# EAGLE design ChargeBoost (EAGLE 7.7.0)
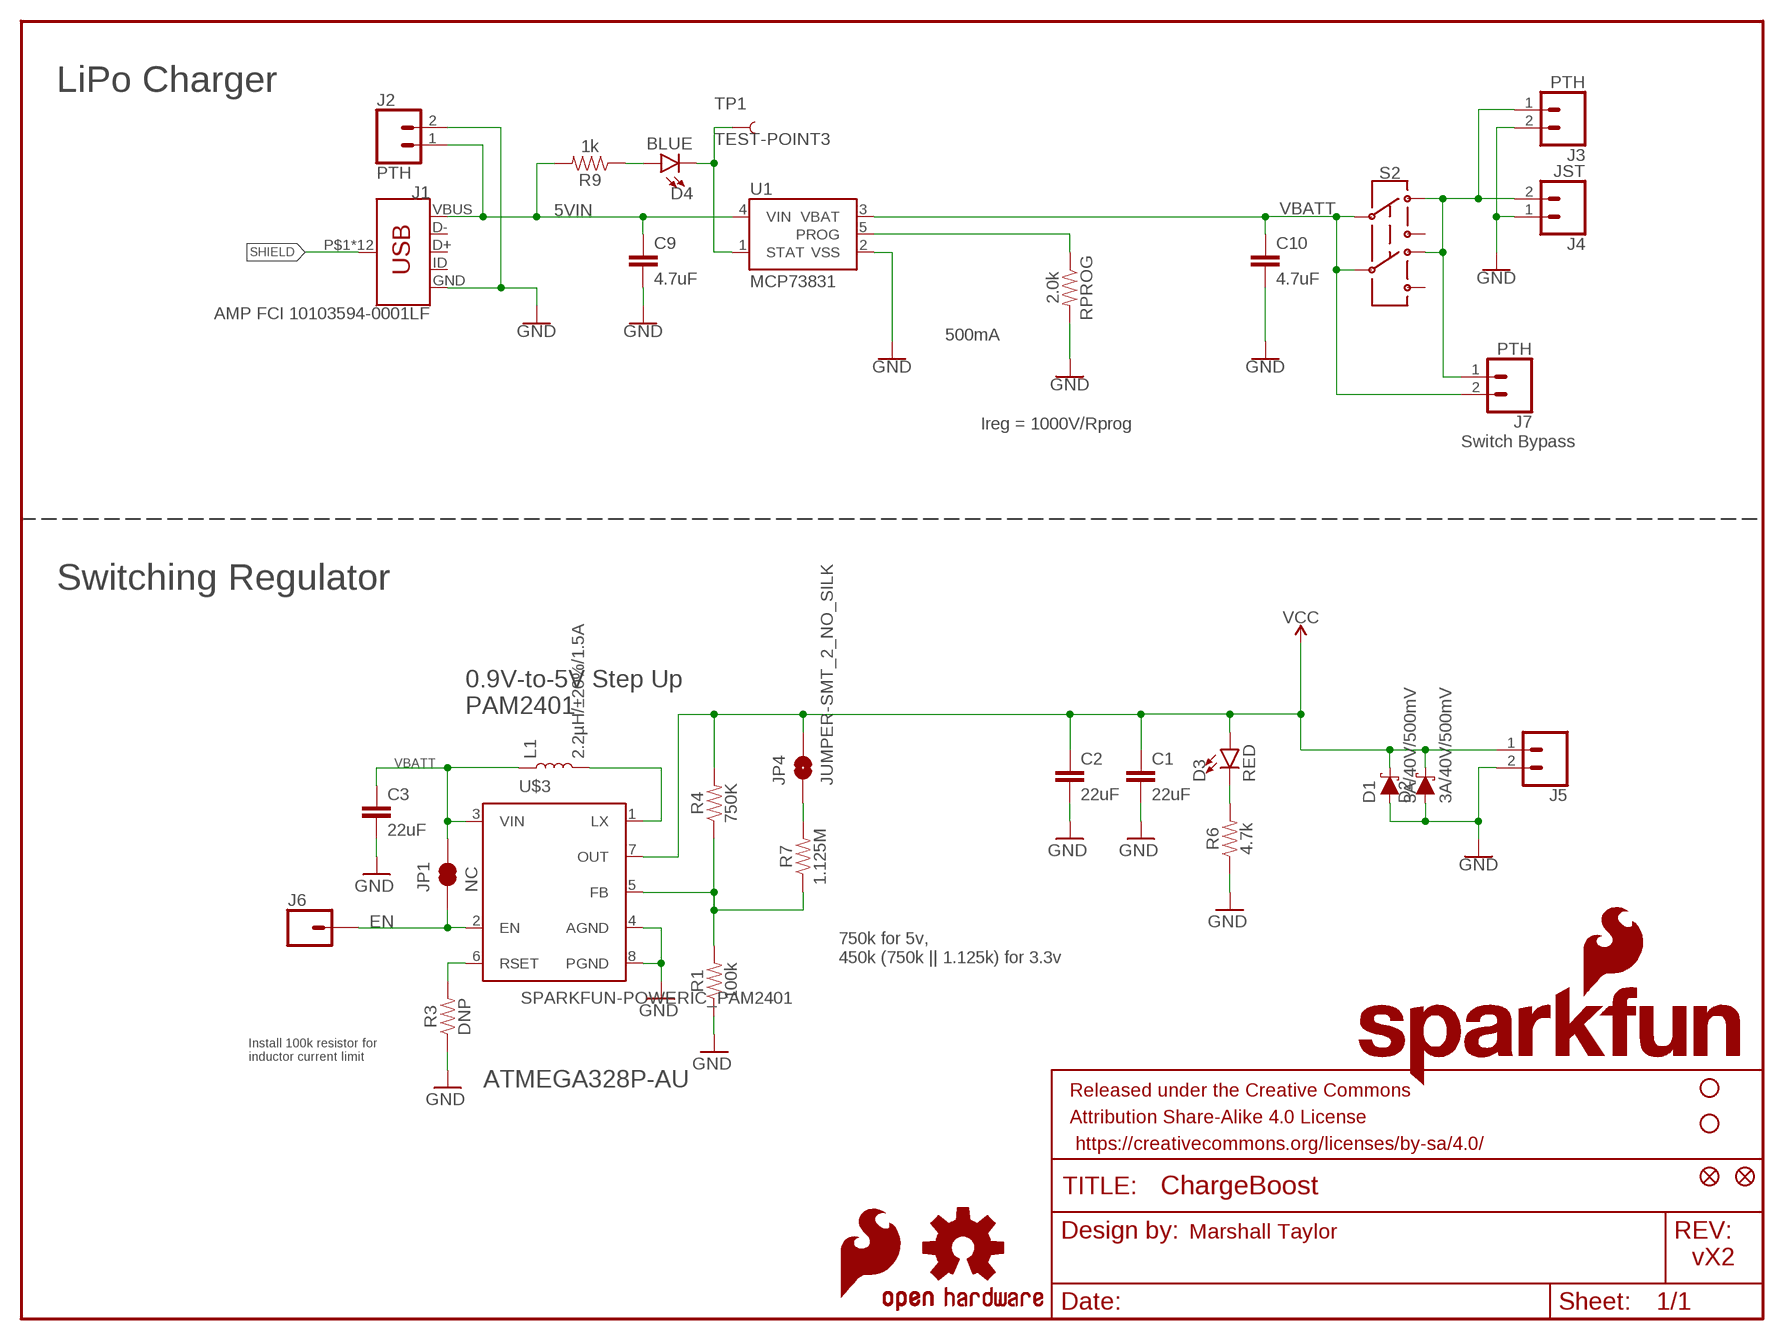
[diagram p0: schematic, sheet 1]

## Parts
C1  22uF  22UF-0805-6.3V-20%  [0805]
C2  22uF  22UF-0805-6.3V-20%  [0805]
C3  22uF  22UF-0805-6.3V-20%  [0805]
C9  4.7uF  4.7UF0603  [0603]
C10  4.7uF  4.7UF0603  [0603]
D1  3A/40V/500mV  DIODE-SCHOTTKY-B340A  [SMA-DIODE]
D2  3A/40V/500mV  DIODE-SCHOTTKY-B340A  [SMA-DIODE]
D3  RED  LED-RED0603  [LED-0603]
D4  BLUE  LED-BLUE0603  [LED-0603]
FRAME1  FRAME-LETTER  [CREATIVE_COMMONS]
J1  AMP FCI 10103594-0001LF  USB_MICRO-B_HALF_PTH  [USB-MICROB-PTH]
J2  PTH  CONN_02  [1X02]
J3  PTH  CONN_02  [1X02]
J4  JST  CONN_02-JST-2MM-SMT  [JST-2-SMD]
J5  CONN_02  [1X02]
J6  CONN_01  [1X01]
J7  PTH  CONN_02  [1X02]
JP1  NC  JUMPER-SMT_2_NC_TRACE_NO-SILK  [SMT-JUMPER_2_NC_TRACE_NO-SILK]
JP2  FIDUCIAL1X2  [FIDUCIAL-1X2]
JP3  SFE_LOGO_NAME_FLAME.1_INCH  [SFE_LOGO_NAME_FLAME_.1]
JP4  JUMPER-SMT_2_NO_SILK  [SMT-JUMPER_2_NO_SILK]
JP6  STAND-OFF  [STAND-OFF]
JP7  STAND-OFF  [STAND-OFF]
JP16  FIDUCIAL1X2  [FIDUCIAL-1X2]
L1  2.2µH/±20%/1.5A  INDUCTORCOPY-VLF4012AT-2.2UH  [INDUCTOR_2.2UHCOPY]
LOGO1  SFE_LOGO_FLAME.1_INCH  [SFE_LOGO_FLAME_.1]
R1  100k  100KOHM-0603-1/10W-1%  [0603]
R3  DNP  100KOHM-0603-1/10W-1%  [0603]
R4  750K  750OHM-0603-1/10W-1%  [0603]
R6  4.7k  4.7KOHM-0603-1/10W-1%  [0603]
R7  1.125M  750OHM-0603-1/10W-1%  [0603]
R9  1k  1KOHM-0603-1/10W-1%  [0603]
RPROG  2.0k  2.0KOHM-0603-1/10W-5%  [0603]
S2  SWITCH-DPDT-SMD-AYZ0202  [SWITCH_DPDT_SMD_AYZ0202]
TP1  TEST-POINT3  [PAD.03X.03]
U1  MCP73831  [SOT23-5]
U$1  OSHW-LOGOS  [OSHW-LOGO-S]
U$3  SPARKFUN-POWERIC_PAM2401  [SPARKFUN-POWERIC_MSOP8]

## Nets
5VIN: C9.1 J1.VBUS J2.1 R9.2 U1.4(VIN)
EN: J6.1 JP1.1 U$3.2(EN)
GND: C1.2 C2.2 C3.2 C9.2 C10.2 D1.A D2.A J1.GND J2.2 J3.2 J4.1 J5.2 R1.1 R3.1 R6.1 RPROG.2 U1.2(VSS) U$3.4(AGND) U$3.8(PGND)
N$1: JP4.1 R7.2
N$2: D3.C R6.2
N$3: D4.A R9.1
N$4: L1.P$2 U$3.1(LX)
N$6: R3.2 U$3.6(RSET)
N$9: J3.1 J4.2 J7.1 S2.1 S2.4
N$11: RPROG.1 U1.5(PROG)
N$12: R1.2 R4.1 R7.1 U$3.5(FB)
N$14: D4.C TP1.P$1 U1.1(STAT)
SHIELD: J1.P$1(SHIELD) J1.P$2(SHIELD) J1.P$3(SHIELD) J1.P$4(SHIELD) J1.P$6(SHIELD) J1.P$8(SHIELD) J1.P$10(SHIELD) J1.P$12(SHIELD) J1.SHEILD2(SHIELD) J1.SHIELD J1.SHIELD3(SHIELD) J1.SHIELD4(SHIELD)
VBATT: C3.1 C10.1 J7.2 JP1.2 L1.P$1 S2.2 S2.5 U1.3(VBAT) U$3.3(VIN)
VCC: C1.1 C2.1 D1.C D2.C D3.A J5.1 JP4.2 R4.2 U$3.7(OUT)
Unconnected: J1.D+ J1.D- J1.ID S2.3 S2.6

## Notes on the sheet
- LiPo Charger
- 500mA
- Ireg = 1000V/Rprog
- Switch Bypass
- Switching Regulator
- 0.9V-to-5V Step Up
  PAM2401
- 750k for 5v,
  450k (750k || 1.125k) for 3.3v
- Install 100k resistor for
  inductor current limit
- ATMEGA328P-AU
- Marshall Taylor
- vX2

## Library data of the parts
C1-C3 = SparkFun-Capacitors:22UF: 22µF ceramic capacitors A capacitor is a passive two-terminal electrical component used to store electrical energy temporarily in an electric field.; PROD_ID: CAP-08402
C9 C10 = SparkFun-Capacitors:4.7UF: 4.7µF ceramic capacitors A capacitor is a passive two-terminal electrical component used to store electrical energy temporarily in an electric field.; PROD_ID: CAP-08280
D1 D2 = SparkFun-DiscreteSemi:DIODE-SCHOTTKY: Schottky diode A Schottky diode is a semiconductor diode which has a low forward voltage drop and a very fast switching action.; PROD_ID: DIO-09886
D3 = SparkFun-LED:LED-RED: Red SMD LED Used in manufacturing of most products at SparkFun Packages: 0603 - SMD 0603 package [Product Link] <http://docs.avagotech.com/docs/AV02-0551EN> 0603 SMART - SMD 0603 SMART package ( more efficient and expensive)[Product Link] <http://www.osram-os.com/Graphics/XPic2/00077099_0.pdf> 1206 - SMD1206 package [Product Link] <https://www.sparkfun.com/datasheets/DevTools/LilyPad/Q150OVS4.pdff> SparkFun Products: Pro Mini 328 -5V <https://www.sparkfun.com/products/821> RedBoard <https://www.sparkfun.com/products/12757> IOIO-OTG <https://www.sparkfun.com/products/13613>; PROD_ID: DIO-00819
D4 = SparkFun-LED:LED-BLUE: Blue SMD LED Used in manufacturing of various products at SparkFun Packages: 0603 - SMD 0603 package [Product Link] <http://www.digikey.com/product-detail/en/SMLE12BC7TT86/511-1589-2-ND/1641808> 1206 - SMD1206 package [Product Link] <http://www.digikey.com/product-detail/en/lite-on-inc/LTST-C150TBKT/160-1643-1-ND/573584> SparkFun Products: ESP8266 Thing-Dev Board <https://www.sparkfun.com/products/13711> RedBoard <https://www.sparkfun.com/products/12757>; PROD_ID: DIO-08575
FRAME1 = SparkFun-Aesthetics:FRAME-LETTER: Schematic Frame - Letter Standard 8.5x11 US Letter frame
J1 = SparkFun-Connectors:USB_MICRO-B: USB Type Micro-B Connector Male/female and PTH/SMT variants SparkFun Products: SparkFun microB USB Breakout <https://www.sparkfun.com/products/12035> SparkFun USB microB Plug Breakout <https://www.sparkfun.com/products/10031> SparkFun ESP8266 Thing <https://www.sparkfun.com/products/13231>; PROD_ID: CONN-13711
J2 J3 J5 J7 = SparkFun-Connectors:CONN_02: Multi connection point. Often used as Generic Header-pin footprint for 0.1 inch spaced/style header connections On any of the 0.1 inch spaced packages, you can populate with these: Break Away Headers - Straight <https://www.sparkfun.com/products/116> (PRT-00116) Break Away Male Headers - Right Angle <https://www.sparkfun.com/products/553> (PRT-00553) Female Headers <https://www.sparkfun.com/products/115> (PRT-00115) Break Away Headers - Machine Pin <https://www.sparkfun.com/products/117> (PRT-00117) Break Away Female Headers - Swiss Machine Pin <https://www.sparkfun.com/products/743> (PRT-00743) For SCREWTERMINALS and SPRING TERMINALS visit here: Screw Terimnals on SparkFun.com <https://www.sparkfun.com/search/results?term=Screw+Terminals> (5mm/3.5mm/2.54mm spacing) This device is also useful as a general connection point to wire up your design to another part of your project. Our various solder wires solder well into these plated through hole pads. Hook-Up Wire - Assortment (Stranded, 22 AWG) <https://www.sparkfun.com/products/11375> (PRT-11375) Hook-Up Wire - Assortment (Solid Core, 22 AWG) <https://www.sparkfun.com/products/11367> (PRT-11367) View the entire wire category on our website here <https://www.sparkfun.com/categories/141> Special notes: Molex polarized connector foot print use with: PRT-08233 with associated crimp pins and housings. 2.54_SCREWTERM for use with PRT-10571. 3.5mm Screw Terminal footprints for PRT-08084 5mm Screw Terminal footprints for use with PRT-08432
J4 = SparkFun-Connectors:CONN_02: Multi connection point. Often used as Generic Header-pin footprint for 0.1 inch spaced/style header connections On any of the 0.1 inch spaced packages, you can populate with these: Break Away Headers - Straight <https://www.sparkfun.com/products/116> (PRT-00116) Break Away Male Headers - Right Angle <https://www.sparkfun.com/products/553> (PRT-00553) Female Headers <https://www.sparkfun.com/products/115> (PRT-00115) Break Away Headers - Machine Pin <https://www.sparkfun.com/products/117> (PRT-00117) Break Away Female Headers - Swiss Machine Pin <https://www.sparkfun.com/products/743> (PRT-00743) For SCREWTERMINALS and SPRING TERMINALS visit here: Screw Terimnals on SparkFun.com <https://www.sparkfun.com/search/results?term=Screw+Terminals> (5mm/3.5mm/2.54mm spacing) This device is also useful as a general connection point to wire up your design to another part of your project. Our various solder wires solder well into these plated through hole pads. Hook-Up Wire - Assortment (Stranded, 22 AWG) <https://www.sparkfun.com/products/11375> (PRT-11375) Hook-Up Wire - Assortment (Solid Core, 22 AWG) <https://www.sparkfun.com/products/11367> (PRT-11367) View the entire wire category on our website here <https://www.sparkfun.com/categories/141> Special notes: Molex polarized connector foot print use with: PRT-08233 with associated crimp pins and housings. 2.54_SCREWTERM for use with PRT-10571. 3.5mm Screw Terminal footprints for PRT-08084 5mm Screw Terminal footprints for use with PRT-08432; PROD_ID: CONN-11443
J6 = SparkFun-Connectors:CONN_01: Single connection point. Often used as Generic Header-pin footprint for 0.1 inch spaced/style header connections On any of the 0.1 inch spaced packages, you can populate with these: Break Away Headers - Straight <https://www.sparkfun.com/products/116> (PRT-00116) Break Away Male Headers - Right Angle <https://www.sparkfun.com/products/553> (PRT-00553) Female Headers <https://www.sparkfun.com/products/115> (PRT-00115) Break Away Headers - Machine Pin <https://www.sparkfun.com/products/117> (PRT-00117) Break Away Female Headers - Swiss Machine Pin <https://www.sparkfun.com/products/743> (PRT-00743) This device is also useful as a general connection point to wire up your design to another part of your project. Our various solder wires solder well into these plated through hole pads. Hook-Up Wire - Assortment (Stranded, 22 AWG) <https://www.sparkfun.com/products/11375> (PRT-11375) Hook-Up Wire - Assortment (Solid Core, 22 AWG) <https://www.sparkfun.com/products/11367> (PRT-11367) View the entire wire category on our website here <https://www.sparkfun.com/categories/141> Special notes: SMTSO-256-ET is a "flush mount" nut for a 4-40 screw. We mostly use this on specialty testbeds; it is a nice way to connect hardware to your PCB at an adjustable hieght. Also note, the SNAP packages are for using a snappable style connector. We sell a baggie of snaps and they are also used on two LilyPad designs: Snap Assortment - 30 pack (male and female) <https://www.sparkfun.com/products/11347> (DEV-11347) LilyPad Arduino SimpleSnap <https://www.sparkfun.com/products/10941> (DEV-10941) LilyPad SimpleSnap Protoboard <https://www.sparkfun.com/products/10940> (DEV-10940)
JP1 = SparkFun-Jumpers:JUMPER-SMT_2_NC_TRACE: Normally closed trace jumper This jumper has a trace between two pads so it's normally closed (NC). Use a razor knife to open the connection. For best results follow the IPC guidelines for cutting traces: Cutout at least 0.063 mm (0.005 in). Remove all loose material to clean up the cut area. Seal the cut with an approved epoxy. Reapply solder to reclose the connection.
JP2 JP16 = SparkFun-Aesthetics:FIDUCIAL: Fiducial Alignment Points Point-of-reference for pick-and-place machines and other optical instruments.
JP3 = SparkFun-Aesthetics:SFE_LOGO_NAME_FLAME: SparkFun Font Logo w/ Flame This is the SparkFun full logo. The logo on the schematic will always be the same size; the package variant is the height of the flame part of the logo. Default layer for the logo on the board is tSilk.
JP4 = SparkFun-Jumpers:JUMPER-SMT_2_NO: Normally open jumper This jumper has two pads in close proximity to each other. Apply solder to close the connection. Round pads are easier to solder for beginners, but are a lot larger. SparkFun Product that uses the round pads: SparkFun EL Sequencer <https://www.sparkfun.com/products/12781>
JP6 JP7 = SparkFun:STAND-OFF: Stand Off This is the mechanical footprint for a #4 phillips button head screw. Use the keepout ring to avoid running the screw head into surrounding components. SKU : PRT-00447
L1 = DuplicatedCoils:INDUCTORCOPY: Inductors Resist changes in electrical current. Basically a coil of wire. SparkFun Products: SparkFun Load Cell Amplifier - HX711 <https://www.sparkfun.com/products/13879> IOIO-OTG - V2.2 <https://www.sparkfun.com/products/13613>; PROD_ID: NDUC-09513
LOGO1 = SparkFun-Aesthetics:SFE_LOGO_FLAME: SparkFun Flame Logo This is the SparkFun flame logo. The logo on the schematic will always be the same size; the package variant is the height of the flame. Default layer for the logo on the board is tSilk.
R1 = SparkFun-Resistors:100KOHM: 100kΩ resistor A resistor is a passive two-terminal electrical component that implements electrical resistance as a circuit element. Resistors act to reduce current flow, and, at the same time, act to lower voltage levels within circuits. - Wikipedia; PROD_ID: RES-07828
R3 = SparkFun-Resistors:100KOHM: 100kΩ resistor A resistor is a passive two-terminal electrical component that implements electrical resistance as a circuit element. Resistors act to reduce current flow, and, at the same time, act to lower voltage levels within circuits. - Wikipedia; PROD_ID: RES-07828; VALUE: 100k
R4 R7 = SparkFun-Resistors:750OHM: 750Ω resistor A resistor is a passive two-terminal electrical component that implements electrical resistance as a circuit element. Resistors act to reduce current flow, and, at the same time, act to lower voltage levels within circuits. - Wikipedia; PROD_ID: RES-07824; VALUE: 750
R6 = SparkFun-Resistors:4.7KOHM: 4.7kΩ resistor A resistor is a passive two-terminal electrical component that implements electrical resistance as a circuit element. Resistors act to reduce current flow, and, at the same time, act to lower voltage levels within circuits. - Wikipedia; PROD_ID: RES-07857
R9 = SparkFun-Resistors:1KOHM: 1kΩ resistor A resistor is a passive two-terminal electrical component that implements electrical resistance as a circuit element. Resistors act to reduce current flow, and, at the same time, act to lower voltage levels within circuits. - Wikipedia; PROD_ID: RES-07856
RPROG = SparkFun-Resistors:2.0KOHM: 2kΩ resistor A resistor is a passive two-terminal electrical component that implements electrical resistance as a circuit element. Resistors act to reduce current flow, and, at the same time, act to lower voltage levels within circuits. - Wikipedia; PROD_ID: RES-08296
S2 = SparkFun-Switches:SWITCH-DPDT: Double-Pole, Double-Throw (DPDT) Switch Double-pole, double-throw switches. Variant Overview PTH-GPI-152-3013 Used on SparkFun Geiger Counter <https://www.sparkfun.com/products/11345> SMD-AY0202 Surface Mount DPDT Switch <https://www.sparkfun.com/products/597> (COM-00597) Used on e.g. LilyPad Arduino USB - ATmega32U4 Board <https://www.sparkfun.com/products/12049>; PROD_ID: SWCH-08179; SF_SKU: COM-00597
TP1 = SparkFun-Connectors:TEST-POINT: SparkFun Test Points Bare copper test points for troubleshooting or In-Circuit-Testing. These are used by our Production team for verifying production board runs using pogo-pins on test beds. SparkFun Products: SparkFun LSM9DS1 Breakout <https://www.sparkfun.com/products/13284> SparkFun PSOC <https://www.sparkfun.com/products/13714> SparkFun Load Cell Amplifier <https://www.sparkfun.com/products/13879>
U1 = SparkFun-IC-Power:MCP73831: MCP73831T Li-Ion, Li-Pol Controller Miniature single cell, fully integrated Li-Ion, Li-polymer charge management controller Datasheet <http://ww1.microchip.com/downloads/en/DeviceDoc/20001984g.pdf> SparkFun Products: SparkFun ESP32 Thing <https://www.sparkfun.com/products/13907> SparkFun 9DoF Razor IMU M0 <https://www.sparkfun.com/products/14001>; PROD_ID: IC-09995
U$1 = SparkFun:OSHW-LOGO: Open Source Hardware Logo This logo indicates the piece of hardware it is found on incorporates a OSHW license and/or adheres to the definition of open source hardware found here: http://freedomdefined.org/OSHW
U$3 = Apo Board 2017 ATmega328SMD_PAM2401:SPARKFUN-POWERIC_PAM2401

## Net classes
0 default: width 0.152 mm, drill 0.305 mm, clearance 0.152 mm

## Board
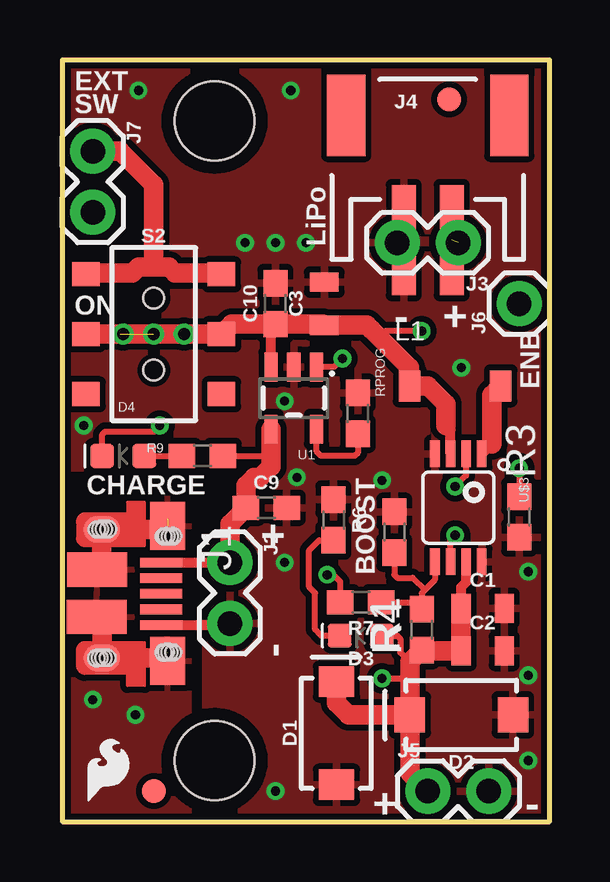
[diagram p1: board, top side]
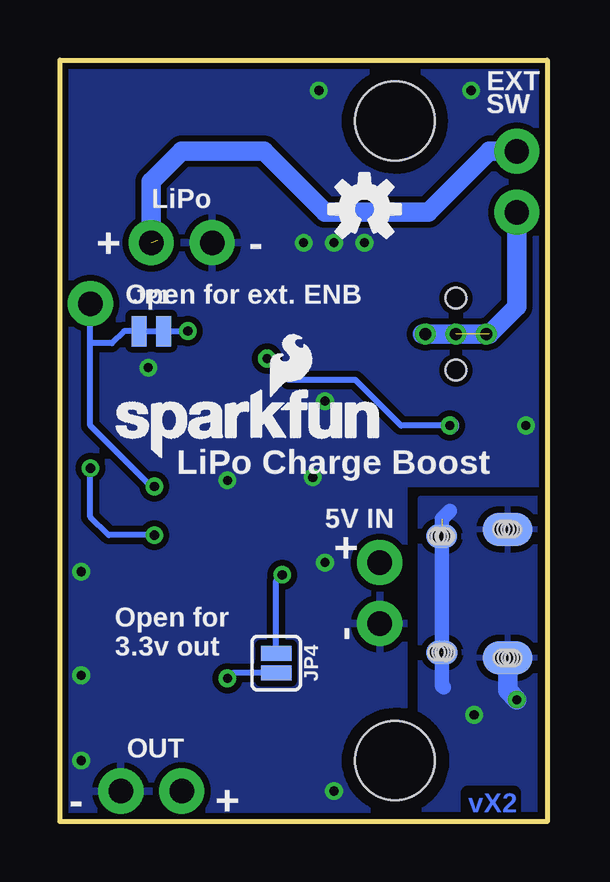
[diagram p2: board, bottom side, seen from below]

Size 20.32 x 31.75 mm. Coordinates in mm from the lower left corner, seen from the top.
Outline: 0,0 20.32,0 20.32,31.75 0,31.75 0,0
Copper layers (1*16): Top 0.035mm / dielectric 1.5mm / Bottom 0.035mm
Design rules "SparkFun-2-layer-TIGHT": minimum track width 7mil, minimum drill 15mil, track to track 7mil, track to pad 7mil, pad to pad 7mil, via to via 7mil, smd to smd 7mil, copper to edge 7mil, drill to drill 7mil, minimum pad ring 7mil, minimum via ring 7mil, stop-mask expansion 4mil, vias tented up to drill 25mil, thermal gap 10mil

### Footprints (pad centres in the part's own frame; a part is rotated, then mirrored left to right if it is on the bottom)
0805 = smd 0.8 x 1.2: 1 -0.9,0; 2 0.9,0
0603 = smd 1.1 x 1: 1 -0.85,0; 2 0.85,0
SMA-DIODE = smd 1.27 x 1.47: A -2.15,0; C 2.15,0
LED-0603 = smd 1 x 1: A -0.877,0; C 0.877,0
USB-MICROB-PTH = smd 0.4 x 1.75: D+ 0.031,1.331; D- -0.619,1.331; GND 1.331,1.331; ID 0.681,1.331; VBUS -1.269,1.331 | smd 1.4 x 2.1 bottom: P$1 2.701,-1.142; P$3 -2.659,-1.144 | smd 1 x 1.3: P$2 2.487,1.594; P$6 -2.368,1.604 | smd 1 x 1.3 bottom: P$4 -2.368,1.604; P$10 2.481,1.598 | smd 1.1 x 1.5: P$8 2.701,-1.142; P$12 -2.659,-1.144 | smd 2 x 1.46: SHEILD2 2.831,1.606; SHIELD -2.794,1.606 | smd 1.425 x 2.5: SHIELD3 -0.979,-1.349; SHIELD4 0.996,-1.352 | hole 0.66: -2.659,-0.879; 2.477,1.821; 2.461,1.666; 2.481,1.426; 2.467,1.536; -2.659,-1.059; -2.659,-1.219; -2.649,-1.349; 2.701,-0.899; 2.701,-1.079; 2.701,-1.239; 2.711,-1.369; -2.369,1.821; -2.359,1.691; -2.369,1.541; -2.364,1.432
1X02 = drill 1.016 pad 1.88: 1 0,0; 2 2.54,0
JST-2-SMD = smd 1 x 4.6: 1 -1,-3.7; 2 1,-3.7 | smd 1.6 x 3.4: NC1 -3.4,1.5; NC2 3.4,1.5
1X01 = drill 1.016 pad 1.88: 1 0,0
SMT-JUMPER_2_NC_TRACE_NO-SILK = smd 0.635 x 1.27: 1 -0.508,0; 2 0.508,0
FIDUCIAL-1X2 = smd 1 x 1: 1 0,0
SMT-JUMPER_2_NO_SILK = smd 0.635 x 1.27: 1 -0.406,0; 2 0.406,0
STAND-OFF = hole 3.302: 0,0
INDUCTOR_2.2UHCOPY = smd 0.9 x 1.3: P$1 -1.9,0; P$2 1.9,0
SWITCH_DPDT_SMD_AYZ0202 = smd 1 x 1.15: 1 -2.5,2.825; 2 0,2.825; 3 2.5,2.825; 4 -2.5,-2.825; 5 0,-2.825; 6 2.5,-2.825 | hole 0.85: 1.5,0; -1.5,0
PAD.03X.03 = smd 0.762 x 0.762: P$1 0,0
SOT23-5 = smd 0.55 x 1.2: 1 -0.95,-1.3; 2 0,-1.3; 3 0.95,-1.3; 4 0.95,1.3; 5 -0.95,1.3
SPARKFUN-POWERIC_MSOP8 = smd 0.4 x 1.1: 1 -0.975,-2.25; 2 -0.325,-2.25; 3 0.325,-2.25; 4 0.975,-2.25; 5 0.975,2.25; 6 0.325,2.25; 7 -0.325,2.25; 8 -0.975,2.25

### Placement (x,y rotation side)
C1  17.53,8.89 0 top
C2  17.53,7.11 0 top
C3  10.92,21.59 90 top
C9  8.51,13.08 0 top
C10  8.89,21.59 90 top
D1  11.43,3.68 90 top
D2  16.64,4.45 180 top
D3  12.45,7.75 180 top
D4  2.54,15.24 180 top
FRAME1  -24.43,-24.45 0 top  (outside the outline)
J1  2.79,9.53 270 top
J2  6.99,10.79 270 top
J3  16.51,24.13 180 top
J4  15.24,27.94 0 top
J5  15.24,1.27 0 top
J6  19.05,21.59 90 top
J7  1.27,27.94 270 top
JP1  16.51,20.45 0 bottom
JP2  3.81,1.27 0 top
JP3  18.39,15.09 0 bottom
JP4  11.3,6.6 270 bottom
JP6  6.35,2.54 0 top
JP7  6.35,29.21 0 top
JP16  16.13,30.1 0 top
L1  16.38,18.16 0 top
LOGO1  0.76,0.51 0 top
R1  13.84,12.06 270 top
R3  19.05,12.7 90 top
R4  14.99,8 270 top
R6  11.3,12.57 270 top
R7  12.45,9.14 180 top
R9  5.84,15.24 0 top
RPROG  12.32,17.02 90 top
S2  3.81,20.32 270 top
TP1  4.06,16.51 0 bottom
U1  9.65,17.65 180 top
U$1  7.62,25.53 0 bottom
U$3  16.51,13.08 180 top

### Tracks (layer width: path | path; a pad name or v marks a point on that pad's centre or on a via)
5VIN
  Top 0.254: R9.2 8.64,15.24
  Top 0.406: J1.VBUS J2.1 | 8.7,14.92 8.7,15.24 8.64,15.24
  Top 0.813: U1.4 8.7,14.92 8.7,14.8 8.26,14.35 8,14.35 7.66,14.01 C9.1 6.99,12.41 J2.1
EN  (via drill 0.38)
  Top 0.254: U$3.2 16.84,14.42 v16.38,13.97
  Bottom 0.254: v16.38,13.97 16.51,13.97 19.05,16.51 19.05,19.94 | 19.05,19.94 J6.1 | JP1.1 17.65,20.45 18.16,19.94 19.05,19.94
GND  (via drill 0.38)
  Top 0.406: J1.GND 6.92,8.19 J2.2
  other vias: 9.27,10.79 8.89,1.27 19.43,2.54 19.43,6.1 19.43,10.41 16.64,18.92 13.34,14.22 9.78,14.35 9.27,17.53 8.89,24.13 7.62,24.13 10.16,24.13 9.53,30.48 3.17,30.48 0.89,16.51
  pour Top (isolate 0.254): 0,31.75 20.32,31.75 20.32,0 5.97,0 5.97,14.73 0,14.73
  pour Bottom (isolate 0.254): 0,31.75 20.32,31.75 20.32,0 5.97,0 5.97,14.1 0,14.1
N$1  (via drill 0.38)
  Top 0.254: R7.2 11.6,9.99 11.3,10.29 v11.05,10.29
  Bottom 0.254: JP4.1 11.3,10.03 v11.05,10.29
N$2
  Top 0.254: D3.C 10.79,7.75 10.54,8 10.54,9.53 10.29,9.78 10.29,11.3 10.71,11.72 R6.2
N$3
  Top 0.254: D4.A R9.1
N$4
  Top 0.406: U$3.1 17.9,15.75 17.91,15.75
  Top 0.813: 17.91,15.75 17.91,17.79 L1.P$2
N$6  (via drill 0.38)
  Top 0.254: U$3.6 16.18,11.74 v16.38,11.94 | v19.05,14.73 R3.2
  Bottom 0.254: v16.38,11.94 18.29,11.94 19.05,12.7 v19.05,14.73
N$9  (1 unrouted)
  Top 0.813: S2.1 6.59,22.86 4.7,22.86 4.45,23.11 3.94,23.11 | 3.94,23.11 3.17,23.11 2.92,22.86 1.02,22.86 S2.4 | 3.94,23.11 3.81,23.24 3.81,26.54 2.41,27.94 J7.1
  Bottom 0.813: J3.1 16.51,26.67 15.24,27.94 11.81,27.94 9.27,25.4 4.95,25.4 2.41,27.94 J7.1
N$11
  Top 0.254: RPROG.1 12.32,15.37 12.19,15.24 10.79,15.24 10.6,15.43 U1.5
N$12
  Top 0.254: U$3.5 15.54,10.07 15.11,9.65 | 15.11,9.65 14.99,9.53 R4.1 14.69,9.14 R7.1 | R1.2 13.84,10.29 13.97,10.16 14.61,10.16 15.11,9.65
N$14  (via drill 0.38)
  Top 0.254: D4.C 1.66,16.14 1.78,16.26 3.81,16.26 TP1.P$1 | v11.68,19.3 11.33,18.95 U1.1
  Bottom 0.254: TP1.P$1 6.1,16.51 8,18.41 10.79,18.41 v11.68,19.3
  other vias: 4.06,16.51
SHIELD  (via drill 0.38)  (3 unrouted)
  Top 0.813: J1.P$4 4.11,12.18 J1.P$3 1.65,10.71 J1.SHIELD3 | J1.SHEILD2 4.27,6.82 J1.P$8 1.65,8.32 J1.SHIELD4
  Bottom 0.61: 4.32,5.59 4.39,5.66 J1.P$2 J1.P$4 4.4,12.62 4.06,12.95
  Bottom 0.813: J1.P$8 1.65,5.46 v1.27,5.08
  other vias: 3.05,4.45
  pour Bottom (isolate 0.305): 5.27,13.46 0,13.46 0,0 5.27,0
  pour Top (isolate 0.254): 0,13.46 5.27,13.46 5.27,0 0,0
VBATT  (via drill 0.38, 0.51)  (2 unrouted)
  Top 0.254: v14.99,20.45 13.46,20.45 13.34,20.32 13.08,20.32 12.89,20.51
  Top 0.406: U$3.3 16.18,16.33 16,16.51 | U1.3 8.7,20.55 C10.1
  Top 0.813: 16,16.51 16,17.4 15.24,18.16 L1.P$1 14.48,18.92 12.89,20.51 12.71,20.69 C3.1 10.87,20.74 C10.1 7.05,20.74 S2.2 v5.08,20.32 S2.5
  Bottom 0.254: JP1.2 v14.99,20.45
  Bottom 0.813: J7.2 1.27,21.46 2.41,20.32 v5.08,20.32 5.21,20.32
  other vias: 3.81,20.32 2.54,20.32
VCC  (via drill 0.38)
  Top 0.254: D3.A 13.97,7.75 14.1,7.62 14.1,7.04 14.49,6.65 | v13.34,5.97 14.49,5.97
  Top 0.406: U$3.7 16.84,9.98 16.63,9.77 C1.1
  Top 0.813: J5.1 14.49,2.02 D2.C | D1.C 11.43,4.95 11.94,4.45 D2.C | D2.C 14.49,5.97 14.49,6.65 R4.2 15.03,7.11 C2.1 C1.1
  Bottom 0.254: JP4.2 13.11,6.2 v13.34,5.97

### Text on the board
Bottom: vX2
tPlace: EXT / SW | LiPo | - | + | ON | ENB | CHARGE | + | BOOST | - | + | -
bPlace: EXT / SW | LiPo | - | + | Open for ext. ENB | LiPo Charge Boost | + | 5V IN | - | Open for / 3.3v out | OUT | + | -
Measures: Units: Inches
tDocu: Aaron Weiss, Patrick Alberts, Toni Klopfenstein | Marshall Taylor